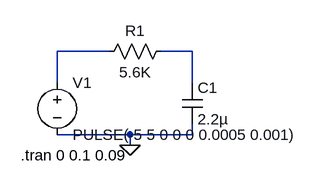
[diagram p0: schematic Integrator.asc]
Integrator.asc, the LTspice schematic file:
Version 4
SHEET 1 880 680
WIRE 160 112 80 112
WIRE 288 112 240 112
WIRE 80 160 80 112
WIRE 288 160 288 112
WIRE 192 240 80 240
WIRE 288 240 288 224
WIRE 288 240 192 240
WIRE 192 256 192 240
FLAG 192 256 0
SYMBOL res 256 96 R90
WINDOW 0 0 56 VBottom 2
WINDOW 3 32 56 VTop 2
SYMATTR InstName R1
SYMATTR Value 5.6K
SYMBOL voltage 80 144 R0
WINDOW 123 0 0 Left 0
WINDOW 39 0 0 Left 0
SYMATTR InstName V1
SYMATTR Value PULSE(-5 5 0 0 0 0.0005 0.001)
SYMBOL cap 272 160 R0
SYMATTR InstName C1
SYMATTR Value 2.2µ
TEXT 24 272 Left 2 !.tran 0 0.1 0.09

The netlist it stands for:
* Integrator.asc
R1 N002 N001 5.6K
V1 N001 0 PULSE(-5 5 0 0 0 0.0005 0.001)
C1 N002 0 2.2µ
.tran 0 0.1 0.09
.backanno
.end